# Altium schematic sheet 2_Filter.SCHDOC
size 297 x 209 mm; SheetNumber: 3; SheetTotal: 18; DocumentName: 2_Filter.SCHDOC
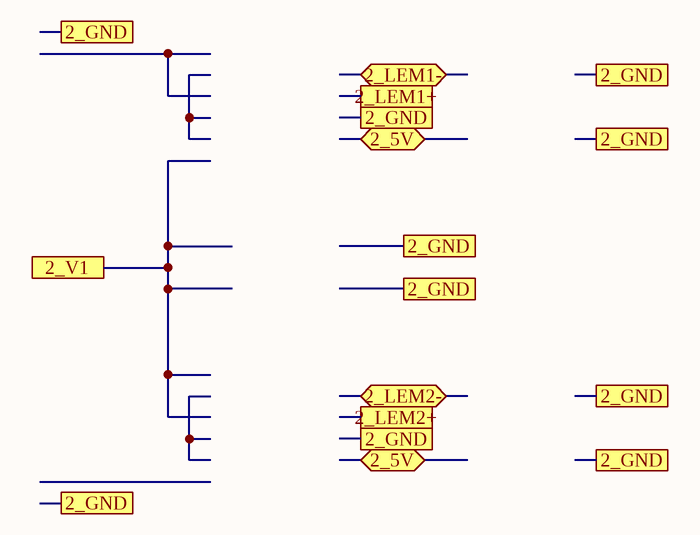
[diagram p0: 2_Filter.SCHDOC]

## Ports
2_5V (bidir), 2_GND, 2_LEM1+, 2_LEM1- (bidir), 2_LEM2+, 2_LEM2- (bidir), 2_V1

## Notes on the sheet
- A
- B
- C
- D
- 1
- 2
- 3
- Title
- 4
- Size
- A4
- Number
- Rev
- Date
- Filename
- Drawn by
- Sheet
- of